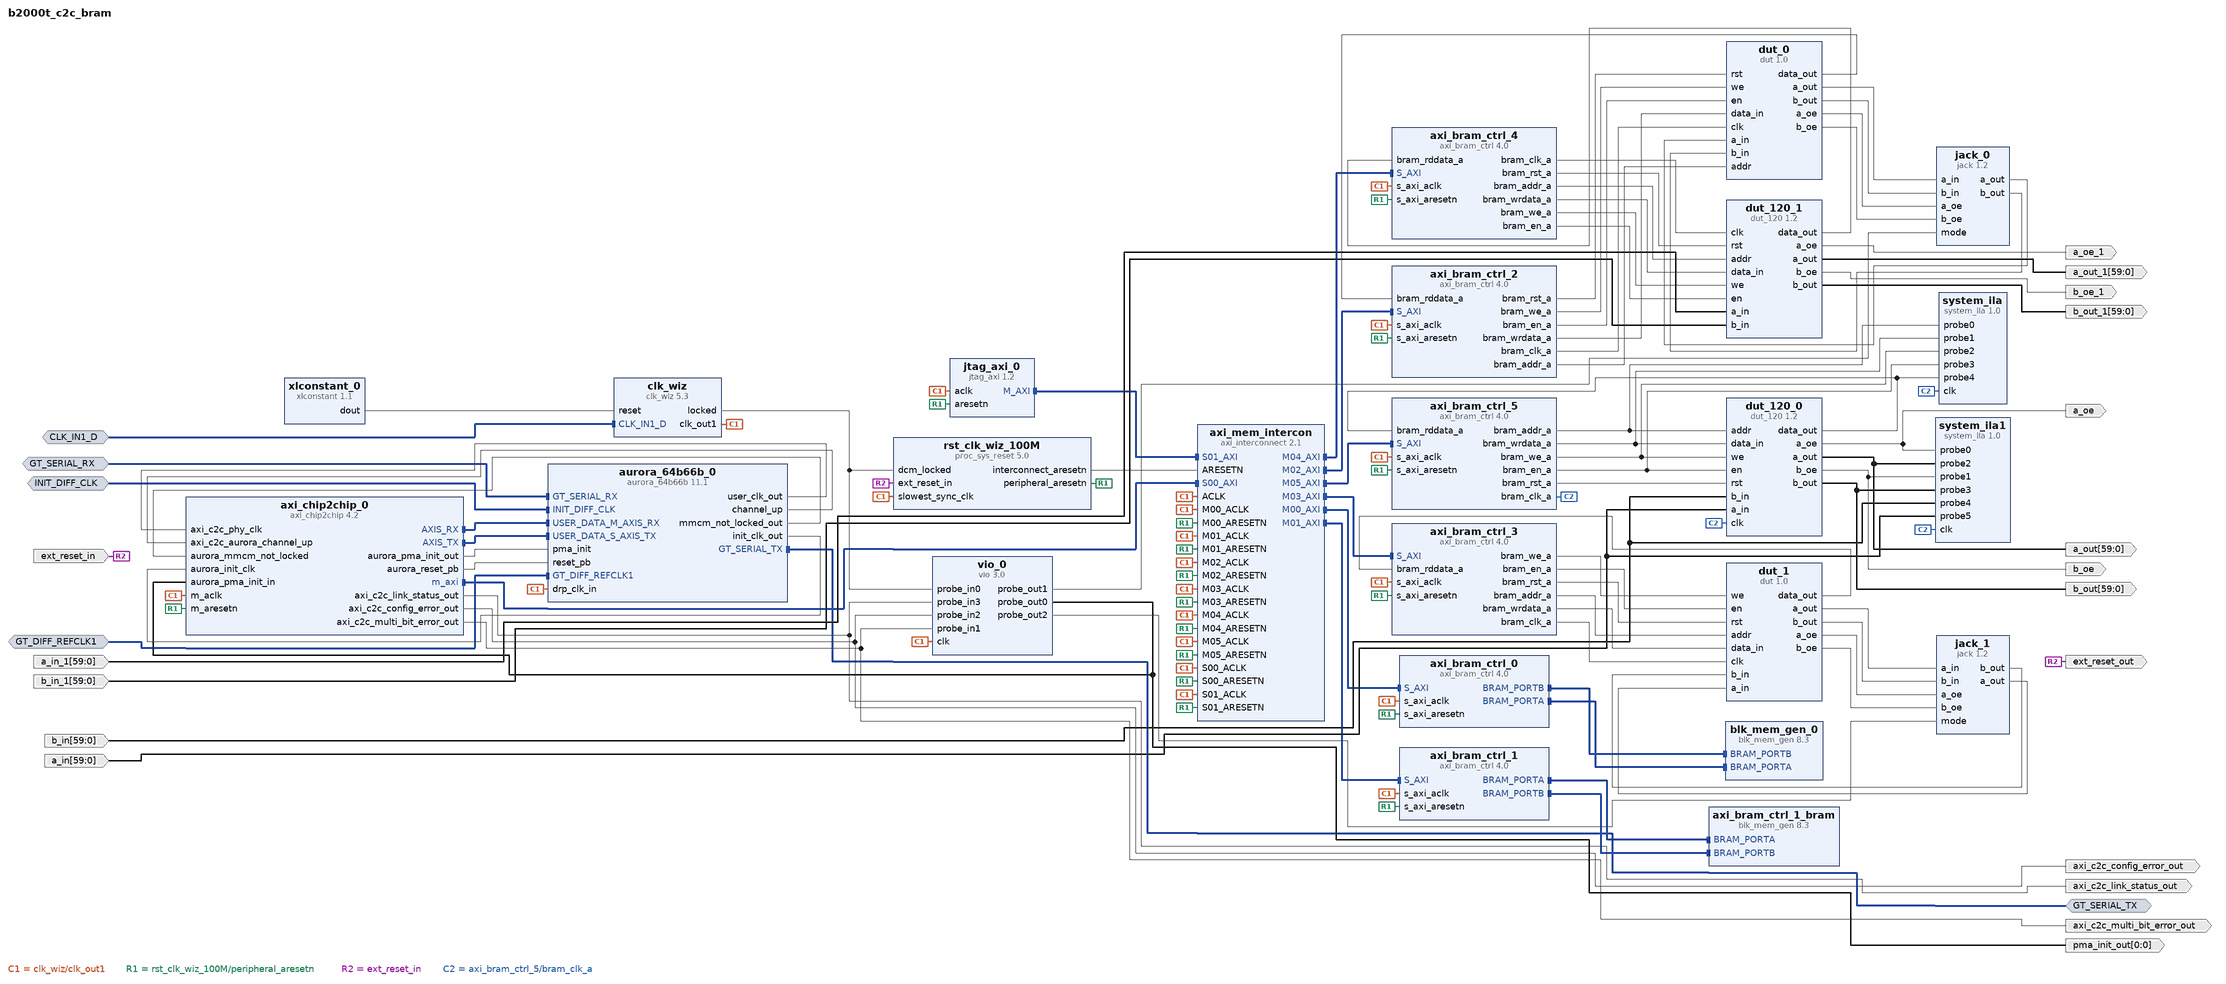
[diagram p0: block diagram of the top level]
# Vivado block design b2000t_c2c_bram, xc7v2000tflg1925-1, Vivado 2016.4
create_bd_design b2000t_c2c_bram

create_bd_intf_port -mode Master -vlnv xilinx.com:display_aurora:GT_Serial_Transceiver_Pins_TX_rtl:1.0 GT_SERIAL_TX
create_bd_intf_port -mode Slave -vlnv xilinx.com:display_aurora:GT_Serial_Transceiver_Pins_RX_rtl:1.0 GT_SERIAL_RX
create_bd_intf_port -mode Slave -vlnv xilinx.com:interface:diff_clock_rtl:1.0 INIT_DIFF_CLK
create_bd_intf_port -mode Slave -vlnv xilinx.com:interface:diff_clock_rtl:1.0 CLK_IN1_D
create_bd_intf_port -mode Slave -vlnv xilinx.com:interface:diff_clock_rtl:1.0 GT_DIFF_REFCLK1
set_property -dict {CONFIG.FREQ_HZ 125000000} [get_bd_intf_ports GT_DIFF_REFCLK1]
create_bd_port -dir O -from 0 -to 0 pma_init_out
create_bd_port -dir O axi_c2c_link_status_out
create_bd_port -dir O axi_c2c_config_error_out
create_bd_port -dir O axi_c2c_multi_bit_error_out
create_bd_port -dir I -type rst ext_reset_in
create_bd_port -dir O ext_reset_out
create_bd_port -dir O a_oe
create_bd_port -dir O b_oe
create_bd_port -dir O -from 59 -to 0 a_out
create_bd_port -dir O -from 59 -to 0 b_out
create_bd_port -dir O a_oe_1
create_bd_port -dir O b_oe_1
create_bd_port -dir O -from 59 -to 0 a_out_1
create_bd_port -dir O -from 59 -to 0 b_out_1
create_bd_port -dir I -from 59 -to 0 a_in
create_bd_port -dir I -from 59 -to 0 b_in
create_bd_port -dir I -from 59 -to 0 a_in_1
create_bd_port -dir I -from 59 -to 0 b_in_1

create_bd_cell -type ip -vlnv xilinx.com:ip:axi_chip2chip:4.2 axi_chip2chip_0
set_property -dict [list \
  CONFIG.C_AXI_WUSER_WIDTH 0 \
  CONFIG.C_AXI_ID_WIDTH 7 \
  CONFIG.C_INTERFACE_MODE 1 \
  CONFIG.C_INTERFACE_TYPE 2 \
  CONFIG.C_COMMON_CLK 0 \
  CONFIG.C_MASTER_FPGA 0 \
  CONFIG.C_AURORA_WIDTH 1 \
  CONFIG.C_USE_DIFF_IO false \
  CONFIG.C_USE_DIFF_CLK false \
  CONFIG.C_DISABLE_CLK_SHIFT false \
  CONFIG.C_DISABLE_DESKEW false \
] [get_bd_cells axi_chip2chip_0]
create_bd_cell -type ip -vlnv xilinx.com:ip:aurora_64b66b:11.1 aurora_64b66b_0
set_property -dict [list \
  CONFIG.C_LINE_RATE 6.25 \
  CONFIG.C_REFCLK_FREQUENCY 125.000 \
  CONFIG.C_INIT_CLK 100.0 \
  CONFIG.DRP_FREQ 150.0 \
  CONFIG.interface_mode Streaming \
  CONFIG.C_USE_CHIPSCOPE true \
  CONFIG.drp_mode Disabled \
  CONFIG.SupportLevel 1 \
] [get_bd_cells aurora_64b66b_0]
create_bd_cell -type ip -vlnv xilinx.com:ip:axi_interconnect:2.1 axi_mem_intercon
set_property -dict {CONFIG.NUM_SI 2 CONFIG.NUM_MI 6} [get_bd_cells axi_mem_intercon]
create_bd_cell -type ip -vlnv xilinx.com:ip:clk_wiz:5.3 clk_wiz
set_property -dict [list \
  CONFIG.PRIM_IN_FREQ 100 \
  CONFIG.CLKIN1_JITTER_PS 100.0 \
  CONFIG.CLKOUT1_REQUESTED_OUT_FREQ 150.00 \
  CONFIG.PRIM_SOURCE Differential_clock_capable_pin \
  CONFIG.MMCM_DIVCLK_DIVIDE 2 \
  CONFIG.MMCM_CLKFBOUT_MULT_F 19.875 \
  CONFIG.MMCM_CLKIN1_PERIOD 10.0 \
  CONFIG.MMCM_CLKOUT0_DIVIDE_F 6.625 \
  CONFIG.CLKOUT1_JITTER 143.858 \
  CONFIG.CLKOUT1_PHASE_ERROR 157.402 \
] [get_bd_cells clk_wiz]
create_bd_cell -type ip -vlnv xilinx.com:ip:proc_sys_reset:5.0 rst_clk_wiz_100M
create_bd_cell -type ip -vlnv xilinx.com:ip:vio:3.0 vio_0
set_property -dict [list \
  CONFIG.C_PROBE_OUT4_WIDTH 60 \
  CONFIG.C_PROBE_OUT3_WIDTH 60 \
  CONFIG.C_PROBE_OUT2_WIDTH 26 \
  CONFIG.C_PROBE_OUT1_WIDTH 26 \
  CONFIG.C_NUM_PROBE_OUT 5 \
  CONFIG.C_NUM_PROBE_IN 4 \
] [get_bd_cells vio_0]
create_bd_cell -type ip -vlnv xilinx.com:ip:jtag_axi:1.2 jtag_axi_0
create_bd_cell -type ip -vlnv xilinx.com:ip:xlconstant:1.1 xlconstant_0
set_property -dict {CONFIG.CONST_VAL 0} [get_bd_cells xlconstant_0]
create_bd_cell -type ip -vlnv xilinx.com:ip:axi_bram_ctrl:4.0 axi_bram_ctrl_1
create_bd_cell -type ip -vlnv xilinx.com:ip:axi_bram_ctrl:4.0 axi_bram_ctrl_0
create_bd_cell -type ip -vlnv xilinx.com:ip:blk_mem_gen:8.3 blk_mem_gen_0
set_property -dict [list \
  CONFIG.Memory_Type True_Dual_Port_RAM \
  CONFIG.Enable_B Use_ENB_Pin \
  CONFIG.Use_RSTB_Pin true \
  CONFIG.Port_B_Clock 100 \
  CONFIG.Port_B_Write_Rate 50 \
  CONFIG.Port_B_Enable_Rate 100 \
] [get_bd_cells blk_mem_gen_0]
create_bd_cell -type ip -vlnv xilinx.com:ip:blk_mem_gen:8.3 axi_bram_ctrl_1_bram
set_property -dict {CONFIG.Memory_Type True_Dual_Port_RAM} [get_bd_cells axi_bram_ctrl_1_bram]
create_bd_cell -type ip -vlnv xilinx.com:ip:axi_bram_ctrl:4.0 axi_bram_ctrl_2
set_property -dict {CONFIG.SINGLE_PORT_BRAM 1} [get_bd_cells axi_bram_ctrl_2]
create_bd_cell -type ip -vlnv user.org:user:jack:1.2 jack_0
create_bd_cell -type ip -vlnv user.org:user:dut:1.0 dut_0
create_bd_cell -type ip -vlnv xilinx.com:ip:axi_bram_ctrl:4.0 axi_bram_ctrl_3
set_property -dict {CONFIG.SINGLE_PORT_BRAM 1} [get_bd_cells axi_bram_ctrl_3]
create_bd_cell -type ip -vlnv user.org:user:dut:1.0 dut_1
create_bd_cell -type ip -vlnv user.org:user:jack:1.2 jack_1
create_bd_cell -type ip -vlnv xilinx.com:ip:axi_bram_ctrl:4.0 axi_bram_ctrl_4
set_property -dict {CONFIG.SINGLE_PORT_BRAM 1} [get_bd_cells axi_bram_ctrl_4]
create_bd_cell -type ip -vlnv xilinx.com:ip:axi_bram_ctrl:4.0 axi_bram_ctrl_5
set_property -dict {CONFIG.SINGLE_PORT_BRAM 1} [get_bd_cells axi_bram_ctrl_5]
create_bd_cell -type ip -vlnv xilinx.com:ip:system_ila:1.0 system_ila
set_property -dict [list \
  CONFIG.C_PROBE4_TYPE 0 \
  CONFIG.C_PROBE3_TYPE 0 \
  CONFIG.C_PROBE2_TYPE 0 \
  CONFIG.C_PROBE1_TYPE 0 \
  CONFIG.C_PROBE0_TYPE 0 \
  CONFIG.C_NUM_OF_PROBES 5 \
  CONFIG.C_MON_TYPE NATIVE \
] [get_bd_cells system_ila]
create_bd_cell -type ip -vlnv xilinx.com:ip:system_ila:1.0 system_ila1
set_property -dict [list \
  CONFIG.C_PROBE3_TYPE 0 \
  CONFIG.C_PROBE2_TYPE 0 \
  CONFIG.C_PROBE1_TYPE 0 \
  CONFIG.C_PROBE0_TYPE 0 \
  CONFIG.C_NUM_OF_PROBES 6 \
  CONFIG.C_TRIGOUT_EN false \
  CONFIG.C_EN_STRG_QUAL 1 \
  CONFIG.C_ADV_TRIGGER true \
  CONFIG.C_PROBE5_MU_CNT 2 \
  CONFIG.C_PROBE4_MU_CNT 2 \
  CONFIG.C_PROBE3_MU_CNT 2 \
  CONFIG.C_PROBE2_MU_CNT 2 \
  CONFIG.C_PROBE1_MU_CNT 2 \
  CONFIG.C_PROBE0_MU_CNT 2 \
  CONFIG.C_TRIGIN_EN false \
  CONFIG.ALL_PROBE_SAME_MU_CNT 2 \
  CONFIG.C_MON_TYPE NATIVE \
] [get_bd_cells system_ila1]
create_bd_cell -type ip -vlnv user.org:user:dut_120:1.2 dut_120_0
create_bd_cell -type ip -vlnv user.org:user:dut_120:1.2 dut_120_1

# ---- connections ----

connect_bd_intf_net [get_bd_intf_pins axi_chip2chip_0/AXIS_RX] [get_bd_intf_pins aurora_64b66b_0/USER_DATA_M_AXIS_RX]
connect_bd_intf_net [get_bd_intf_pins axi_chip2chip_0/AXIS_TX] [get_bd_intf_pins aurora_64b66b_0/USER_DATA_S_AXIS_TX]
connect_bd_intf_net [get_bd_intf_pins jtag_axi_0/M_AXI] [get_bd_intf_pins axi_mem_intercon/S01_AXI]
connect_bd_intf_net [get_bd_intf_pins axi_chip2chip_0/m_axi] [get_bd_intf_pins axi_mem_intercon/S00_AXI]
connect_bd_intf_net [get_bd_intf_pins axi_mem_intercon/M00_AXI] [get_bd_intf_pins axi_bram_ctrl_0/S_AXI]
connect_bd_intf_net [get_bd_intf_pins blk_mem_gen_0/BRAM_PORTB] [get_bd_intf_pins axi_bram_ctrl_0/BRAM_PORTB]
connect_bd_intf_net [get_bd_intf_pins blk_mem_gen_0/BRAM_PORTA] [get_bd_intf_pins axi_bram_ctrl_0/BRAM_PORTA]
connect_bd_intf_net [get_bd_intf_pins axi_mem_intercon/M01_AXI] [get_bd_intf_pins axi_bram_ctrl_1/S_AXI]
connect_bd_intf_net [get_bd_intf_pins axi_bram_ctrl_1_bram/BRAM_PORTA] [get_bd_intf_pins axi_bram_ctrl_1/BRAM_PORTA]
connect_bd_intf_net [get_bd_intf_pins axi_bram_ctrl_1_bram/BRAM_PORTB] [get_bd_intf_pins axi_bram_ctrl_1/BRAM_PORTB]
connect_bd_intf_net [get_bd_intf_pins axi_mem_intercon/M02_AXI] [get_bd_intf_pins axi_bram_ctrl_2/S_AXI]
connect_bd_intf_net [get_bd_intf_pins axi_mem_intercon/M03_AXI] [get_bd_intf_pins axi_bram_ctrl_3/S_AXI]
connect_bd_intf_net [get_bd_intf_pins axi_mem_intercon/M04_AXI] [get_bd_intf_pins axi_bram_ctrl_4/S_AXI]
connect_bd_intf_net [get_bd_intf_pins axi_mem_intercon/M05_AXI] [get_bd_intf_pins axi_bram_ctrl_5/S_AXI]
connect_bd_intf_net [get_bd_intf_ports GT_SERIAL_TX] [get_bd_intf_pins aurora_64b66b_0/GT_SERIAL_TX]
connect_bd_intf_net [get_bd_intf_ports GT_SERIAL_RX] [get_bd_intf_pins aurora_64b66b_0/GT_SERIAL_RX]
connect_bd_intf_net [get_bd_intf_ports INIT_DIFF_CLK] [get_bd_intf_pins aurora_64b66b_0/INIT_DIFF_CLK]
connect_bd_intf_net [get_bd_intf_ports CLK_IN1_D] [get_bd_intf_pins clk_wiz/CLK_IN1_D]
connect_bd_intf_net -intf_net GT_DIFF_REFCLK1_1 [get_bd_intf_ports GT_DIFF_REFCLK1] [get_bd_intf_pins aurora_64b66b_0/GT_DIFF_REFCLK1]
connect_bd_net [get_bd_pins clk_wiz/clk_out1] \
  [get_bd_pins axi_chip2chip_0/m_aclk] [get_bd_pins rst_clk_wiz_100M/slowest_sync_clk] [get_bd_pins vio_0/clk] \
  [get_bd_pins aurora_64b66b_0/drp_clk_in] [get_bd_pins jtag_axi_0/aclk] [get_bd_pins axi_bram_ctrl_0/s_axi_aclk] \
  [get_bd_pins axi_bram_ctrl_1/s_axi_aclk] [get_bd_pins axi_bram_ctrl_2/s_axi_aclk] [get_bd_pins axi_bram_ctrl_3/s_axi_aclk] \
  [get_bd_pins axi_bram_ctrl_4/s_axi_aclk] [get_bd_pins axi_bram_ctrl_5/s_axi_aclk] [get_bd_pins axi_mem_intercon/S00_ACLK] \
  [get_bd_pins axi_mem_intercon/ACLK] [get_bd_pins axi_mem_intercon/M00_ACLK] [get_bd_pins axi_mem_intercon/S01_ACLK] \
  [get_bd_pins axi_mem_intercon/M01_ACLK] [get_bd_pins axi_mem_intercon/M02_ACLK] [get_bd_pins axi_mem_intercon/M03_ACLK] \
  [get_bd_pins axi_mem_intercon/M04_ACLK] [get_bd_pins axi_mem_intercon/M05_ACLK]
connect_bd_net [get_bd_pins clk_wiz/locked] [get_bd_pins rst_clk_wiz_100M/dcm_locked] [get_bd_pins vio_0/probe_in0]
connect_bd_net [get_bd_pins rst_clk_wiz_100M/peripheral_aresetn] \
  [get_bd_pins axi_chip2chip_0/m_aresetn] [get_bd_pins jtag_axi_0/aresetn] [get_bd_pins axi_bram_ctrl_0/s_axi_aresetn] \
  [get_bd_pins axi_bram_ctrl_1/s_axi_aresetn] [get_bd_pins axi_bram_ctrl_2/s_axi_aresetn] \
  [get_bd_pins axi_bram_ctrl_3/s_axi_aresetn] [get_bd_pins axi_bram_ctrl_4/s_axi_aresetn] \
  [get_bd_pins axi_bram_ctrl_5/s_axi_aresetn] [get_bd_pins axi_mem_intercon/S00_ARESETN] \
  [get_bd_pins axi_mem_intercon/M00_ARESETN] [get_bd_pins axi_mem_intercon/S01_ARESETN] \
  [get_bd_pins axi_mem_intercon/M01_ARESETN] [get_bd_pins axi_mem_intercon/M02_ARESETN] \
  [get_bd_pins axi_mem_intercon/M03_ARESETN] [get_bd_pins axi_mem_intercon/M04_ARESETN] \
  [get_bd_pins axi_mem_intercon/M05_ARESETN]
connect_bd_net [get_bd_pins rst_clk_wiz_100M/interconnect_aresetn] [get_bd_pins axi_mem_intercon/ARESETN]
connect_bd_net [get_bd_pins aurora_64b66b_0/user_clk_out] [get_bd_pins axi_chip2chip_0/axi_c2c_phy_clk]
connect_bd_net [get_bd_pins aurora_64b66b_0/channel_up] [get_bd_pins axi_chip2chip_0/axi_c2c_aurora_channel_up]
connect_bd_net [get_bd_pins aurora_64b66b_0/mmcm_not_locked_out] [get_bd_pins axi_chip2chip_0/aurora_mmcm_not_locked]
connect_bd_net [get_bd_pins axi_chip2chip_0/aurora_pma_init_out] [get_bd_pins aurora_64b66b_0/pma_init]
connect_bd_net [get_bd_pins axi_chip2chip_0/aurora_reset_pb] [get_bd_pins aurora_64b66b_0/reset_pb]
connect_bd_net [get_bd_pins aurora_64b66b_0/init_clk_out] [get_bd_pins axi_chip2chip_0/aurora_init_clk]
connect_bd_net [get_bd_pins vio_0/probe_out0] [get_bd_ports pma_init_out] [get_bd_pins axi_chip2chip_0/aurora_pma_init_in]
connect_bd_net [get_bd_pins axi_chip2chip_0/axi_c2c_link_status_out] [get_bd_ports axi_c2c_link_status_out] [get_bd_pins vio_0/probe_in3]
connect_bd_net [get_bd_pins axi_chip2chip_0/axi_c2c_config_error_out] [get_bd_ports axi_c2c_config_error_out] [get_bd_pins vio_0/probe_in2]
connect_bd_net [get_bd_pins axi_chip2chip_0/axi_c2c_multi_bit_error_out] [get_bd_ports axi_c2c_multi_bit_error_out] [get_bd_pins vio_0/probe_in1]
connect_bd_net [get_bd_pins xlconstant_0/dout] [get_bd_pins clk_wiz/reset]
connect_bd_net -net aux_reset_in_1 [get_bd_ports ext_reset_in] [get_bd_ports ext_reset_out] [get_bd_pins rst_clk_wiz_100M/ext_reset_in]
connect_bd_net [get_bd_pins axi_bram_ctrl_2/bram_rst_a] [get_bd_pins dut_0/rst]
connect_bd_net [get_bd_pins axi_bram_ctrl_2/bram_we_a] [get_bd_pins dut_0/we]
connect_bd_net [get_bd_pins axi_bram_ctrl_2/bram_en_a] [get_bd_pins dut_0/en]
connect_bd_net [get_bd_pins dut_0/data_out] [get_bd_pins axi_bram_ctrl_2/bram_rddata_a]
connect_bd_net [get_bd_pins axi_bram_ctrl_2/bram_wrdata_a] [get_bd_pins dut_0/data_in]
connect_bd_net [get_bd_pins axi_bram_ctrl_2/bram_clk_a] [get_bd_pins dut_0/clk]
connect_bd_net [get_bd_pins axi_bram_ctrl_2/bram_addr_a] [get_bd_pins dut_0/addr]
connect_bd_net [get_bd_pins jack_0/a_out] [get_bd_pins dut_0/a_in]
connect_bd_net [get_bd_pins jack_0/b_out] [get_bd_pins dut_0/b_in]
connect_bd_net [get_bd_pins dut_0/a_out] [get_bd_pins jack_0/a_in]
connect_bd_net [get_bd_pins dut_0/b_out] [get_bd_pins jack_0/b_in]
connect_bd_net [get_bd_pins dut_0/a_oe] [get_bd_pins jack_0/a_oe]
connect_bd_net [get_bd_pins dut_0/b_oe] [get_bd_pins jack_0/b_oe]
connect_bd_net [get_bd_pins vio_0/probe_out1] [get_bd_pins jack_0/mode]
connect_bd_net [get_bd_pins jack_1/b_out] [get_bd_pins dut_1/b_in]
connect_bd_net [get_bd_pins jack_1/a_out] [get_bd_pins dut_1/a_in]
connect_bd_net [get_bd_pins dut_1/a_out] [get_bd_pins jack_1/a_in]
connect_bd_net [get_bd_pins dut_1/b_out] [get_bd_pins jack_1/b_in]
connect_bd_net [get_bd_pins dut_1/a_oe] [get_bd_pins jack_1/a_oe]
connect_bd_net [get_bd_pins dut_1/b_oe] [get_bd_pins jack_1/b_oe]
connect_bd_net [get_bd_pins vio_0/probe_out2] [get_bd_pins jack_1/mode]
connect_bd_net [get_bd_pins axi_bram_ctrl_3/bram_we_a] [get_bd_pins dut_1/we]
connect_bd_net [get_bd_pins axi_bram_ctrl_3/bram_en_a] [get_bd_pins dut_1/en]
connect_bd_net [get_bd_pins axi_bram_ctrl_3/bram_rst_a] [get_bd_pins dut_1/rst]
connect_bd_net [get_bd_pins axi_bram_ctrl_3/bram_addr_a] [get_bd_pins dut_1/addr]
connect_bd_net [get_bd_pins axi_bram_ctrl_3/bram_wrdata_a] [get_bd_pins dut_1/data_in]
connect_bd_net [get_bd_pins dut_1/data_out] [get_bd_pins axi_bram_ctrl_3/bram_rddata_a]
connect_bd_net [get_bd_pins axi_bram_ctrl_3/bram_clk_a] [get_bd_pins dut_1/clk]
connect_bd_net [get_bd_pins axi_bram_ctrl_5/bram_clk_a] [get_bd_pins system_ila1/clk] [get_bd_pins system_ila/clk] [get_bd_pins dut_120_0/clk]
connect_bd_net [get_bd_pins axi_bram_ctrl_5/bram_rst_a] [get_bd_pins dut_120_0/rst]
connect_bd_net [get_bd_pins axi_bram_ctrl_5/bram_addr_a] [get_bd_pins system_ila/probe0] [get_bd_pins dut_120_0/addr]
connect_bd_net [get_bd_pins axi_bram_ctrl_5/bram_wrdata_a] [get_bd_pins system_ila/probe1] [get_bd_pins dut_120_0/data_in]
connect_bd_net [get_bd_pins axi_bram_ctrl_5/bram_we_a] [get_bd_pins system_ila/probe2] [get_bd_pins dut_120_0/we]
connect_bd_net [get_bd_pins axi_bram_ctrl_5/bram_en_a] [get_bd_pins system_ila/probe3] [get_bd_pins dut_120_0/en]
connect_bd_net [get_bd_pins dut_120_0/data_out] [get_bd_pins axi_bram_ctrl_5/bram_rddata_a] [get_bd_pins system_ila/probe4]
connect_bd_net [get_bd_pins axi_bram_ctrl_4/bram_clk_a] [get_bd_pins dut_120_1/clk]
connect_bd_net [get_bd_pins axi_bram_ctrl_4/bram_rst_a] [get_bd_pins dut_120_1/rst]
connect_bd_net [get_bd_pins axi_bram_ctrl_4/bram_addr_a] [get_bd_pins dut_120_1/addr]
connect_bd_net [get_bd_pins axi_bram_ctrl_4/bram_wrdata_a] [get_bd_pins dut_120_1/data_in]
connect_bd_net [get_bd_pins axi_bram_ctrl_4/bram_we_a] [get_bd_pins dut_120_1/we]
connect_bd_net [get_bd_pins axi_bram_ctrl_4/bram_en_a] [get_bd_pins dut_120_1/en]
connect_bd_net [get_bd_pins dut_120_1/data_out] [get_bd_pins axi_bram_ctrl_4/bram_rddata_a]
connect_bd_net [get_bd_pins dut_120_0/a_oe] [get_bd_pins system_ila1/probe0] [get_bd_ports a_oe]
connect_bd_net [get_bd_pins dut_120_0/b_oe] [get_bd_pins system_ila1/probe1] [get_bd_ports b_oe]
connect_bd_net [get_bd_pins dut_120_0/a_out] [get_bd_pins system_ila1/probe2] [get_bd_ports a_out]
connect_bd_net [get_bd_pins dut_120_0/b_out] [get_bd_pins system_ila1/probe3] [get_bd_ports b_out]
connect_bd_net -net jack_120_1_b_out [get_bd_ports b_in] [get_bd_pins system_ila1/probe4] [get_bd_pins dut_120_0/b_in]
connect_bd_net -net jack_120_1_a_out [get_bd_ports a_in] [get_bd_pins system_ila1/probe5] [get_bd_pins dut_120_0/a_in]
connect_bd_net [get_bd_pins dut_120_1/a_oe] [get_bd_ports a_oe_1]
connect_bd_net [get_bd_pins dut_120_1/b_oe] [get_bd_ports b_oe_1]
connect_bd_net [get_bd_pins dut_120_1/a_out] [get_bd_ports a_out_1]
connect_bd_net [get_bd_pins dut_120_1/b_out] [get_bd_ports b_out_1]
connect_bd_net -net a_in_1_1 [get_bd_ports a_in_1] [get_bd_pins dut_120_1/a_in]
connect_bd_net -net b_in_1_1 [get_bd_ports b_in_1] [get_bd_pins dut_120_1/b_in]

# ---- address map ----
assign_bd_address -offset 0x76020000 -range 4K -target_address_space [get_bd_addr_spaces axi_chip2chip_0/MAXI] [get_bd_addr_segs axi_bram_ctrl_4/S_AXI/Mem0]
assign_bd_address -offset 0x76021000 -range 4K -target_address_space [get_bd_addr_spaces axi_chip2chip_0/MAXI] [get_bd_addr_segs axi_bram_ctrl_5/S_AXI/Mem0]
assign_bd_address -offset 0x76022000 -range 4K -target_address_space [get_bd_addr_spaces axi_chip2chip_0/MAXI] [get_bd_addr_segs axi_bram_ctrl_2/S_AXI/Mem0]
assign_bd_address -offset 0x76023000 -range 4K -target_address_space [get_bd_addr_spaces axi_chip2chip_0/MAXI] [get_bd_addr_segs axi_bram_ctrl_3/S_AXI/Mem0]
assign_bd_address -offset 0x76024000 -range 4K -target_address_space [get_bd_addr_spaces axi_chip2chip_0/MAXI] [get_bd_addr_segs axi_bram_ctrl_0/S_AXI/Mem0]
assign_bd_address -offset 0x76025000 -range 4K -target_address_space [get_bd_addr_spaces axi_chip2chip_0/MAXI] [get_bd_addr_segs axi_bram_ctrl_1/S_AXI/Mem0]
assign_bd_address -offset 0x76020000 -range 4K -target_address_space [get_bd_addr_spaces jtag_axi_0/Data] [get_bd_addr_segs axi_bram_ctrl_4/S_AXI/Mem0]
assign_bd_address -offset 0x76021000 -range 4K -target_address_space [get_bd_addr_spaces jtag_axi_0/Data] [get_bd_addr_segs axi_bram_ctrl_5/S_AXI/Mem0]
assign_bd_address -offset 0x76022000 -range 4K -target_address_space [get_bd_addr_spaces jtag_axi_0/Data] [get_bd_addr_segs axi_bram_ctrl_2/S_AXI/Mem0]
assign_bd_address -offset 0x76023000 -range 4K -target_address_space [get_bd_addr_spaces jtag_axi_0/Data] [get_bd_addr_segs axi_bram_ctrl_3/S_AXI/Mem0]
assign_bd_address -offset 0x76024000 -range 4K -target_address_space [get_bd_addr_spaces jtag_axi_0/Data] [get_bd_addr_segs axi_bram_ctrl_0/S_AXI/Mem0]
assign_bd_address -offset 0x76025000 -range 4K -target_address_space [get_bd_addr_spaces jtag_axi_0/Data] [get_bd_addr_segs axi_bram_ctrl_1/S_AXI/Mem0]

validate_bd_design
save_bd_design
